# EAGLE design Ninja-towns_modular (EAGLE 7.2.0)
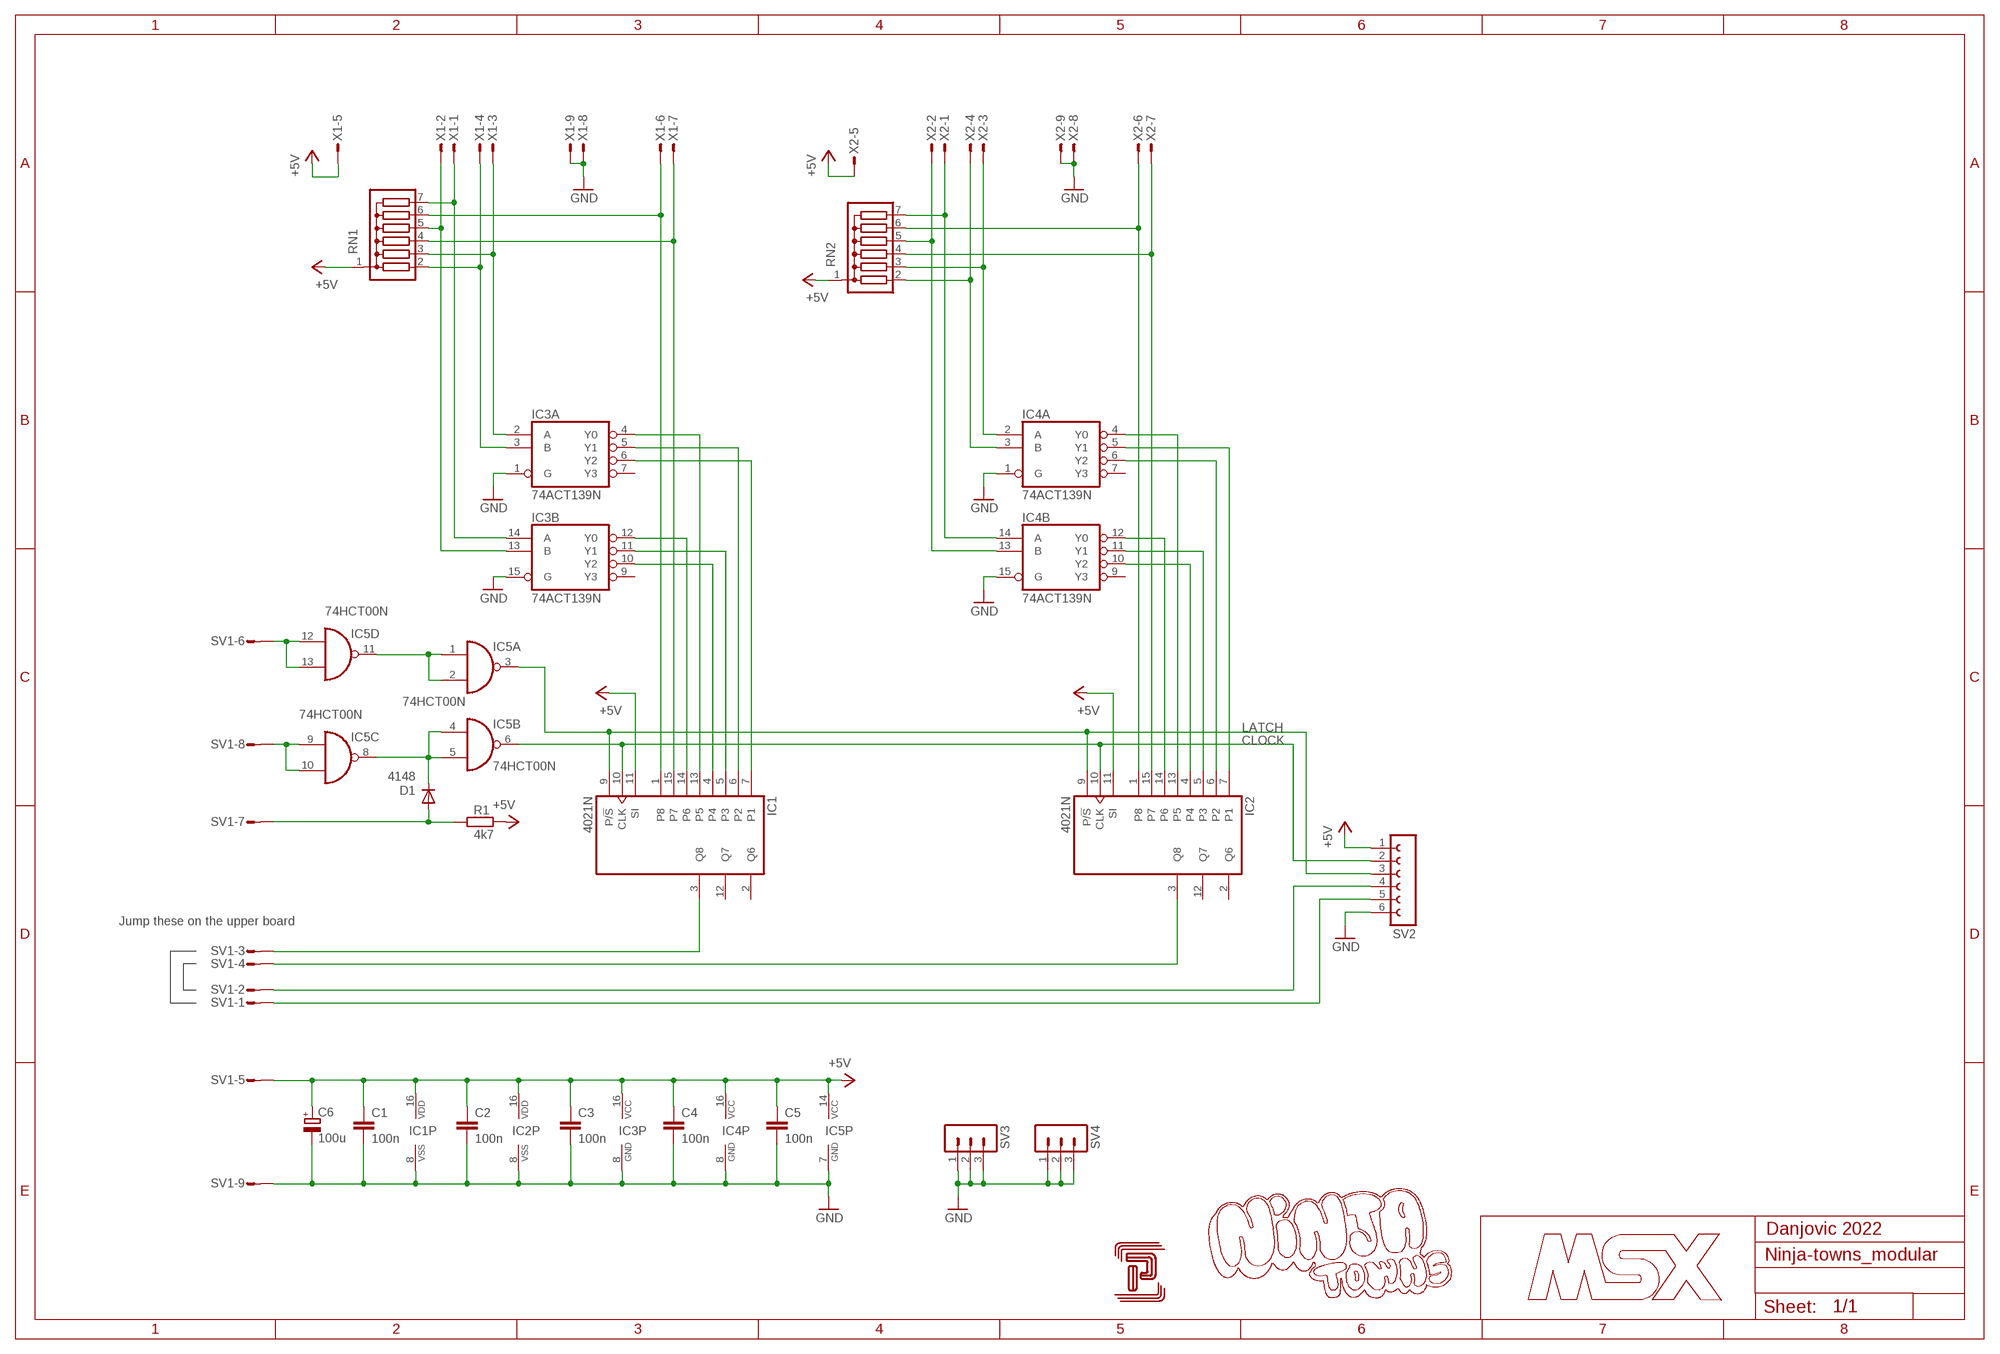
[diagram p0: schematic, sheet 1]

## Parts
C1  100n  C-EU050-024X044  [C050-024X044]
C2  100n  C-EU050-024X044  [C050-024X044]
C3  100n  C-EU050-024X044  [C050-024X044]
C4  100n  C-EU050-024X044  [C050-024X044]
C5  100n  C-EU050-024X044  [C050-024X044]
C6  100u  CPOL-EUE2.5-6  [E2,5-6]
D1  4148  DIODE-D-5  [D-5]
IC1  4021N  [DIL16]
IC2  4021N  [DIL16]
IC3  74ACT139N  [DIL16]
IC4  74ACT139N  [DIL16]
IC5  74HCT00N  [DIL14]
R1  4k7  R-EU_0204/7L  [0204/7L]
RN1  G06R  [SIL7]
RN2  G06R  [SIL7]
SV1  S09P  [S09P]
SV2  FE06-1  [FE06]
SV3  MA03-1  [MA03-1]
SV4  MA03-1  [MA03-1]
U$1  PB-203_TOP  [PB203-TOP]
X1  M09-182S  [182-009-MALE]
X2  M09-182S  [182-009-MALE]

## Nets
+5V: C1.1 C2.1 C3.1 C4.1 C5.1 C6.+ IC1.11(SI) IC1.16(VDD) IC2.11(SI) IC2.16(VDD) IC3.16(P:VCC) IC4.16(P:VCC) IC5.14(P:VCC) R1.1 RN1.1 RN2.1 SV1.5 SV2.1 X1.5 X2.5
CLOCK: IC1.10(CLK) IC2.10(CLK) IC5.6(B:O) SV2.2
GND: C1.2 C2.2 C3.2 C4.2 C5.2 C6.- IC1.8(VSS) IC2.8(VSS) IC3.1(A:G) IC3.8(P:GND) IC3.15(B:G) IC4.1(A:G) IC4.8(P:GND) IC4.15(B:G) IC5.7(P:GND) SV1.9 SV2.6 SV3.1 SV3.2 SV3.3 SV4.1 SV4.2 SV4.3 X1.8 X1.9 X2.8 X2.9
LATCH: IC1.9(P/!S) IC2.9(P/!S) IC5.3(A:O) SV2.3
N$1: IC1.3(Q8) SV1.3
N$2: IC2.3(Q8) SV1.4
N$3: SV1.2 SV2.4
N$4: SV1.1 SV2.5
N$5: D1.C IC5.4(B:I0) IC5.5(B:I1) IC5.8(C:O)
N$7: IC1.1(P8) RN1.6 X1.6
N$8: IC1.15(P7) RN1.4 X1.7
N$9: IC1.14(P6) IC3.12(B:Y0)
N$10: IC1.13(P5) IC3.4(A:Y0)
N$11: IC1.4 IC3.10(B:Y2)
N$12: IC1.5(P3) IC3.11(B:Y1)
N$13: IC1.6(P2) IC3.5(A:Y1)
N$14: IC1.7(P1) IC3.6(A:Y2)
N$15: IC2.1(P8) RN2.6 X2.6
N$16: IC2.15(P7) RN2.4 X2.7
N$17: IC2.14(P6) IC4.12(B:Y0)
N$18: IC2.13(P5) IC4.4(A:Y0)
N$19: IC2.4 IC4.10(B:Y2)
N$20: IC2.5(P3) IC4.11(B:Y1)
N$21: IC2.6(P2) IC4.6(A:Y2)
N$22: IC2.7(P1) IC4.5(A:Y1)
N$39: IC5.1(A:I0) IC5.2(A:I1) IC5.11(D:O)
N$40: IC3.2(A:A) RN1.3 X1.3
N$42: IC5.12(D:I0) IC5.13(D:I1) SV1.6
N$43: IC5.9(C:I0) IC5.10(C:I1) SV1.8
N$44: D1.A R1.2 SV1.7
N$45: IC3.3(A:B) RN1.2 X1.4
N$46: IC3.14(B:A) RN1.7 X1.1
N$47: IC3.13(B:B) RN1.5 X1.2
N$48: IC4.2(A:A) RN2.3 X2.3
N$49: IC4.3(A:B) RN2.2 X2.4
N$50: IC4.14(B:A) RN2.7 X2.1
N$51: IC4.13(B:B) RN2.5 X2.2
Unconnected: IC1.2(Q6) IC1.12(Q7) IC2.2(Q6) IC2.12(Q7) IC3.7(A:Y3) IC3.9(B:Y3) IC4.7(A:Y3) IC4.9(B:Y3)

## Notes on the sheet
- Jump these on the upper board
- Danjovic 2022

## Library data of the parts
C1-C5 = rcl:C-EU: CAPACITOR, European symbol
C6 = rcl:CPOL-EU: POLARIZED CAPACITOR, European symbol
D1 = diode:DIODE-: DIODE
IC1 IC2 = 40xx:4021: 8-bit static SHIFT REGISTER
IC3 IC4 = 74xx-eu:74*139: Dual 2-line to 4-line DECODER/DEMULTIPLEXER
IC5 = 74xx-eu:74*00: Quad 2-input NAND gate
R1 = rcl:R-EU_: RESISTOR, European symbol
RN1 RN2 = resistor-sil:G06R: SIL RESISTOR; OC_FARNELL: unknown; OC_NEWARK: unknown
SV1 = con-amp-mt:S09P: AMP MT CONNECTOR; OC_FARNELL: unknown; OC_NEWARK: unknown
SV2 = con-lsta:FE06-1: FEMALE HEADER; OC_FARNELL: unknown; OC_NEWARK: unknown
SV3 SV4 = con-lstb:MA03-1: PIN HEADER; OC_FARNELL: unknown; OC_NEWARK: unknown
U$1 = box-patola:PB-: PATOLA PB series plastic boxes www.patola.com.br
X1 X2 = con-subd:M09?S: SUB-D; OC_FARNELL: unknown; OC_NEWARK: unknown

## Board
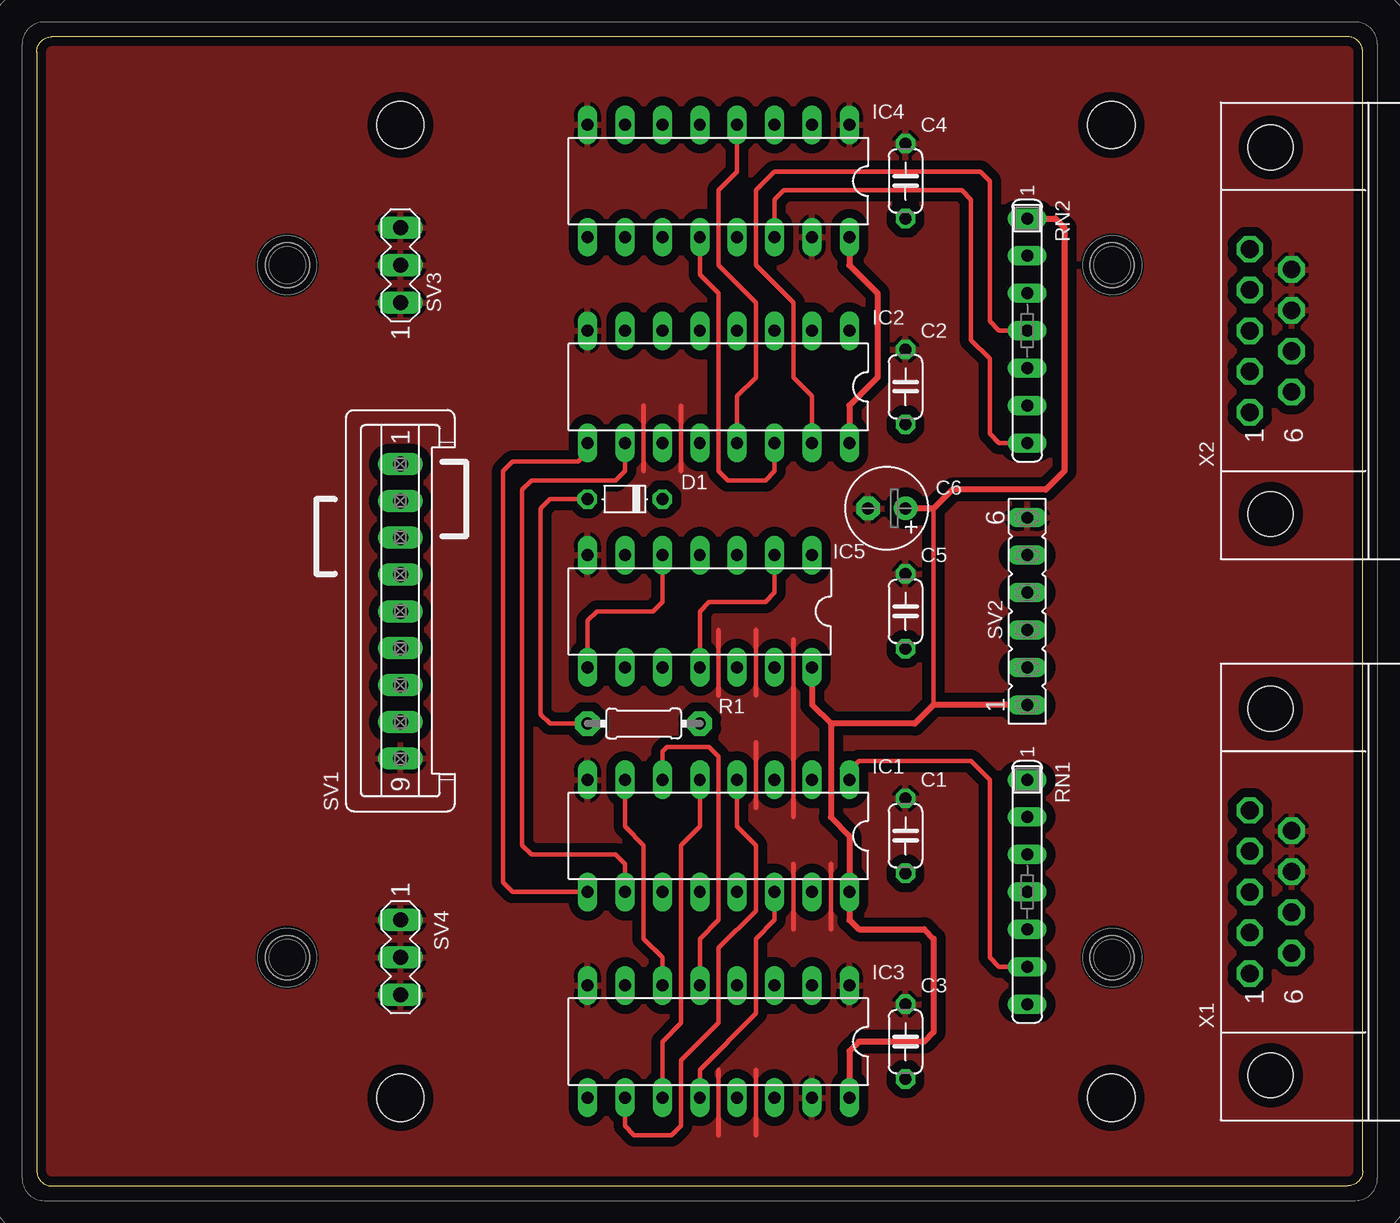
[diagram p1: board, top side]
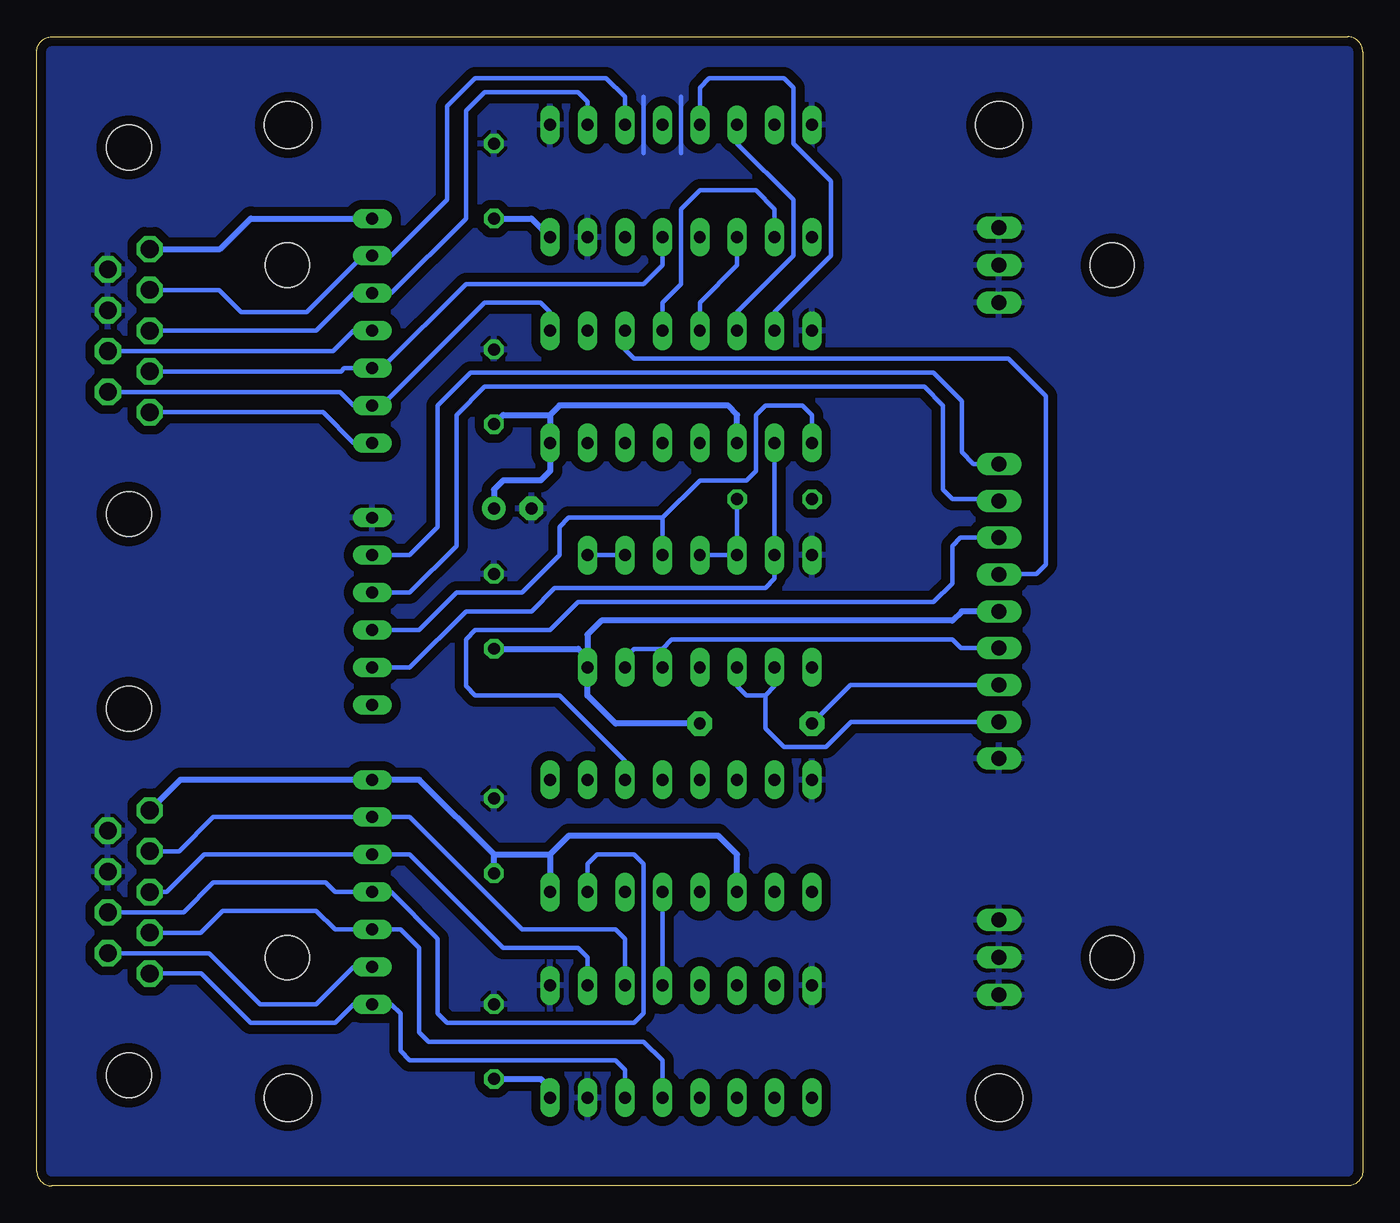
[diagram p2: board, bottom side, seen from below]

Size 90 x 78 mm. Coordinates in mm from the lower left corner, seen from the top.
Copper layers (1*16): Top 0.035mm / dielectric 1.5mm / Bottom 0.035mm
Design rules "default *": minimum track width 10mil, minimum drill 24mil, track to track 8mil, track to pad 8mil, pad to pad 8mil, via to via 8mil, smd to smd 8mil, copper to edge 25mil, drill to drill 8mil, minimum pad ring 10mil, minimum via ring 8mil, stop-mask expansion 4mil, vias tented up to drill 0mil, thermal gap 10mil
Holes 3.2 mm at 72.94,5.98 72.94,72.02 24.68,72.02 24.68,5.98

### Footprints (pad centres in the part's own frame; a part is rotated, then mirrored left to right if it is on the bottom)
C050-024X044 = drill 0.813 octagon: 1 -2.54,0; 2 2.54,0
E2,5-6 = drill 0.813 pad 1.6: + -1.27,0 | drill 0.813 pad 1.6 octagon: - 1.27,0
D-5 = drill 0.813 octagon: A 2.54,0; C -2.54,0
DIL16 = drill 0.813 long: 1 -8.89,-3.81; 2 -6.35,-3.81; 3 -3.81,-3.81; 4 -1.27,-3.81; 5 1.27,-3.81; 6 3.81,-3.81; 7 6.35,-3.81; 8 8.89,-3.81; 9 8.89,3.81; 10 6.35,3.81; 11 3.81,3.81; 12 1.27,3.81; 13 -1.27,3.81; 14 -3.81,3.81; 15 -6.35,3.81; 16 -8.89,3.81
DIL14 = drill 0.813 long: 1 -7.62,-3.81; 2 -5.08,-3.81; 3 -2.54,-3.81; 4 0,-3.81; 5 2.54,-3.81; 6 5.08,-3.81; 7 7.62,-3.81; 8 7.62,3.81; 9 5.08,3.81; 10 2.54,3.81; 11 0,3.81; 12 -2.54,3.81; 13 -5.08,3.81; 14 -7.62,3.81
0204/7L = drill 0.813 pad 1.676 octagon: 1 -3.81,0; 2 3.81,0
SIL7 = drill 0.813 long: 1 -7.62,0; 2 -5.08,0; 3 -2.54,0; 4 0,0; 5 2.54,0; 6 5.08,0; 7 7.62,0
S09P = drill 1.016 long: 1 10,0; 2 7.5,0; 3 5,0; 4 2.5,0; 5 0,0; 6 -2.5,0; 7 -5,0; 8 -7.5,0; 9 -10,0
FE06 = drill 0.813 long: 1 -6.35,0; 2 -3.81,0; 3 -1.27,0; 4 1.27,0; 5 3.81,0; 6 6.35,0
MA03-1 = drill 1.016 long: 1 -2.54,0; 2 0,0; 3 2.54,0
PB203-TOP = hole 3: -28,23.5; 28,23.5; 28,-23.5; -28,-23.5
182-009-MALE = drill 1.194 pad 1.524 octagon: 1 -5.537,10.923; 2 -2.769,10.923; 3 0,10.923; 4 2.769,10.923; 5 5.537,10.923; 6 -4.153,8.08; 7 -1.384,8.08; 8 1.384,8.08; 9 4.153,8.08 | hole 3.048: -12.446,9.501; 12.446,9.501

### Placement (x,y rotation side)
C1  58.97,23.76 90 top
C2  58.97,54.24 90 top
C3  58.97,9.79 90 top
C4  58.97,68.21 90 top
C5  58.97,39 90 top
C6  57.7,45.98 180 top
D1  39.92,46.62 180 top
IC1  46.27,23.76 180 top
IC2  46.27,54.24 180 top
IC3  46.27,9.79 180 top
IC4  46.27,68.21 180 top
IC5  45,39 180 top
R1  41.19,31.38 180 top
RN1  67.23,19.95 270 top
RN2  67.23,58.05 270 top
SV1  24.68,39 90 top
SV2  67.23,39 90 top
SV3  24.68,62.49 90 top
SV4  24.68,15.5 270 top
U$1  45,39 0 top
X1  93.26,19.95 90 top
X2  93.26,58.05 90 top

### Tracks (layer width: path | path; a pad name or v marks a point on that pad's centre or on a via)
+5V
  Top 0.305: 60.88,32.65 60.88,45.98
  Top 0.406: IC4.16 55.16,62.49 57.07,60.59 57.07,54.88 55.16,52.97 IC2.16 | RN2.1 69.13,65.67 69.77,65.03 69.77,48.52 68.5,47.25 62.14,47.25 60.88,45.98 C6.+ | 53.89,31.38 59.61,31.38 60.88,32.65 SV2.1 | 53.89,31.38 53.89,25.03 55.16,23.76 IC1.16 55.16,18.04 55.8,17.41 60.24,17.41 60.88,16.77 60.88,10.42 60.24,9.79 55.8,9.79 55.16,9.15 IC3.16 | IC5.14 52.62,32.65 53.89,31.38
  Bottom 0.406: X2.5 77.56,63.59 75.48,65.67 RN2.1 | IC2.11 42.46,52.34 43.1,52.97 54.53,52.97 55.16,52.34 | 55.16,52.34 IC2.16 55.16,48.52 55.8,47.89 58.34,47.89 58.97,47.25 C6.+ | R1.1 50.72,31.38 52.62,33.28 IC5.14 52.62,35.82 | C4.1 56.43,65.67 IC4.16 | X1.5 80.25,27.57 RN1.1 64.05,27.57 58.97,22.49 | C2.1 58.34,52.34 55.16,52.34 | SV1.5 27.22,39 27.86,38.37 51.67,38.37 52.62,37.41 52.62,35.82 | IC1.11 42.46,22.49 43.73,23.76 53.89,23.76 55.16,22.49 | 55.16,22.49 IC1.16 | 58.97,22.49 55.16,22.49 | C1.1 58.97,22.49 | C3.1 55.8,7.25 55.16,6.61 IC3.16 | C5.1 53.26,36.46 52.62,35.82
CLOCK
  Top 0.305: IC2.10 39.92,48.52 39.29,47.89 33.57,47.89 32.94,47.25 32.94,23.12 33.57,22.49 39.29,22.49 39.92,21.85 IC1.10
  Bottom 0.305: IC2.10 IC5.6 39.92,41.22 40.55,40.59 54.84,40.59 56.43,39 60.88,39 64.69,35.19 SV2.2
GND
  Top 0.305: 43.73,52.97 43.73,48.52 | 46.27,7.88 46.27,3.44 | 51.35,37.09 51.35,25.03 | 41.19,52.97 41.19,48.52 | 48.81,7.88 48.81,3.44 | 51.35,21.85 51.35,17.41 | 53.89,21.85 53.89,17.41 | 48.81,30.11 48.81,25.66 | 48.81,37.73 48.81,33.28 | 46.27,37.73 46.27,33.28
  Bottom 0.305: 46.27,73.93 46.27,70.12 | 48.81,73.93 48.81,70.12
  pour Bottom (isolate 0.61): -0.08,-0.37 90.72,-0.37 90.72,78.37 -0.72,78.37 -0.72,-0.37
  pour Bottom (isolate 0.61): -0.08,-0.37 90.72,-0.37 90.72,78.37 -0.72,78.37 -0.72,-0.37
  pour Top (isolate 0.61): -0.08,-0.37 90.72,-0.37 90.72,78.37 -0.72,78.37 -0.72,-0.37
LATCH
  Top 0.305: IC1.9 32.3,19.95 31.67,20.58 31.67,48.52 32.3,49.16 36.75,49.16 37.38,49.8 IC2.9
  Bottom 0.305: IC2.9 37.38,52.34 38.02,52.97 40.55,52.97 41.19,52.34 41.19,48.52 41.83,47.89 45,47.89 47.54,45.35 | 47.54,45.35 IC5.3 47.54,42.17 | SV2.3 64.05,37.73 61.51,40.27 57.07,40.27 54.53,42.81 54.53,44.71 53.89,45.35 47.54,45.35
N$1
  Bottom 0.305: SV1.3 27.3,44 27.86,43.45 27.86,40.91 29.12,39.63 53.26,39.63 55.16,37.73 60.24,37.73 60.88,37.09 60.88,33.92 60.24,33.28 54.53,33.28 50.08,28.84 IC1.3
N$2
  Bottom 0.305: IC2.3 50.08,56.78 49.45,56.14 24.05,56.14 21.51,53.6 21.51,42.17 22.14,41.54 24.64,41.54 SV1.4
N$3
  Bottom 0.305: SV2.4 64.69,40.27 61.51,43.45 61.51,52.34 59.61,54.24 29.76,54.24 28.49,52.97 28.49,47.25 27.86,46.62 24.8,46.62 SV1.2
N$4
  Bottom 0.305: SV2.5 64.69,42.81 62.78,44.71 62.78,52.97 60.56,55.19 29.12,55.19 27.22,53.29 27.22,49.8 26.43,49 SV1.1
N$5
  Top 0.305: IC5.5 42.46,39.63 41.83,39 38.02,39 37.38,38.37 IC5.8
  Bottom 0.305: D1.C IC5.5 IC5.4
N$7
  Top 0.305: RN1.6 65.32,14.87 64.69,15.5 64.69,27.57 63.42,28.84 55.8,28.84 55.16,28.2 IC1.1
  Bottom 0.305: X1.6 78.31,15.8 75.48,12.96 74.84,12.33 71.03,12.33 70.4,12.96 68.5,14.87 RN1.6
N$8
  Bottom 0.305: X1.7 80.04,18.57 78.02,20.58 70.4,20.58 69.77,19.95 RN1.4 65.95,19.95 62.78,16.77 62.78,11.69 62.14,11.06 49.45,11.06 48.81,11.69 48.81,21.85 49.45,22.49 51.98,22.49 52.62,21.85 IC1.15
N$9
  Top 0.305: IC1.14 50.08,18.04 48.81,16.77 48.81,11.69 45,7.88 IC3.12
N$10
  Bottom 0.305: IC3.4 IC1.13
N$11
  Top 0.305: IC1.4 47.54,24.39 48.81,23.12 48.81,18.68 46.27,16.14 46.27,11.06 43.73,8.52 43.73,4.07 43.1,3.44 40.55,3.44 39.92,4.07 IC3.10
N$12
  Top 0.305: IC3.11 42.46,9.79 43.73,11.06 43.73,23.12 45,24.39 IC1.5
N$13
  Top 0.305: IC3.5 45,16.77 46.27,18.04 46.27,29.16 45.64,29.79 42.78,29.79 42.46,29.47 IC1.6
N$14
  Top 0.305: IC1.7 39.92,24.39 41.19,23.12 41.19,16.77 42.46,15.5 IC3.6
N$15
  Bottom 0.305: X2.6 69.42,53.9 68.5,52.97 RN2.6 66.59,52.97 59.61,59.95 55.8,59.95 55.16,59.32 IC2.1
N$16
  Top 0.305: IC2.15 52.62,53.6 51.35,54.88 51.35,59.95 48.81,62.49 48.81,67.57 50.08,68.84 64.05,68.84 64.69,68.21 64.69,58.68 65.32,58.05 RN2.4
  Bottom 0.305: X2.7 69.88,56.67 68.5,58.05 RN2.4
N$17
  Top 0.305: IC2.14 50.08,48.52 49.45,47.89 46.91,47.89 46.27,48.52 46.27,60.59 45,61.86 IC4.12
N$18
  Top 0.305: IC4.4 47.54,68.84 46.27,67.57 46.27,62.49 48.81,59.95 48.81,54.88 47.54,53.6 IC2.13
N$19
  Bottom 0.305: IC4.10 39.92,66.31 41.19,67.57 45,67.57 46.27,66.31 46.27,61.23 47.54,59.95 IC2.4
N$20
  Bottom 0.305: IC4.11 42.46,62.49 45,59.95 IC2.5
N$21
  Bottom 0.305: IC2.6 42.46,59.32 38.65,63.13 38.65,66.94 42.46,70.75 IC4.6
N$22
  Bottom 0.305: IC2.7 39.92,59.32 36.11,63.13 36.11,68.21 38.65,70.75 38.65,74.56 39.29,75.19 44.37,75.19 45,74.56 IC4.5
N$39
  Top 0.305: IC5.2 50.08,40.27 49.45,39.63 45.64,39.63 45,39 IC5.11
  Bottom 0.305: IC5.2 IC5.1
N$40
  Bottom 0.305: X1.3 81.2,19.95 78.66,22.49 RN1.3 64.69,22.49 58.34,16.14 53.26,16.14 52.62,15.5 IC3.2
N$42
  Bottom 0.305: SV1.6 27.26,36.5 27.86,37.09 46.91,37.09 47.54,36.46 | IC5.12 47.54,36.46 | 47.54,36.46 49.45,36.46 50.08,35.82 IC5.13
N$43
  Bottom 0.305: SV1.8 34.72,31.5 36.43,29.79 39.29,29.79 40.55,31.06 40.55,33.28 | 40.55,33.28 39.92,33.92 IC5.9 | IC5.10 42.46,33.92 41.83,33.28 40.55,33.28
N$44
  Top 0.305: D1.A 34.84,46.62 34.21,45.98 34.21,32.02 34.84,31.38 R1.2
  Bottom 0.305: SV1.7 34.76,34 R1.2
N$45
  Bottom 0.305: X1.4 80.33,22.72 78.02,25.03 RN1.2 64.69,25.03 57.07,17.41 50.72,17.41 50.08,16.77 IC3.3
N$46
  Bottom 0.305: X1.1 78.83,14.41 75.48,11.06 69.77,11.06 68.5,12.33 RN1.7 65.95,12.33 65.32,11.69 65.32,9.15 64.69,8.52 50.72,8.52 50.08,7.88 IC3.14
N$47
  Bottom 0.305: X1.2 78.88,17.18 77.39,18.68 71.03,18.68 69.77,17.41 RN1.5 65.32,17.41 64.05,16.14 64.05,11.06 64.05,10.42 63.42,9.79 62.78,9.79 48.81,9.79 47.54,8.52 IC3.13
N$48
  Bottom 0.305: X2.3 71.03,58.05 68.5,60.59 RN2.3 65.95,60.59 60.88,65.67 60.88,72.97 59.61,74.24 53.26,74.24 52.62,73.61 IC4.2
N$49
  Bottom 0.305: X2.4 77.61,60.82 76.12,59.32 71.67,59.32 67.86,63.13 RN2.2 65.95,63.13 62.14,66.94 62.14,73.29 60.24,75.19 51.35,75.19 50.08,73.93 IC4.3
N$50
  Top 0.305: IC4.14 50.08,66.94 50.72,67.57 62.78,67.57 63.42,66.94 63.42,57.41 64.69,56.14 64.69,51.06 65.32,50.43 RN2.7
  Bottom 0.305: X2.1 70.58,52.51 68.5,50.43 RN2.7
N$51
  Bottom 0.305: X2.2 69.36,55.28 69.13,55.51 RN2.5 66.59,55.51 60.88,61.23 48.81,61.23 47.54,62.49 IC4.13